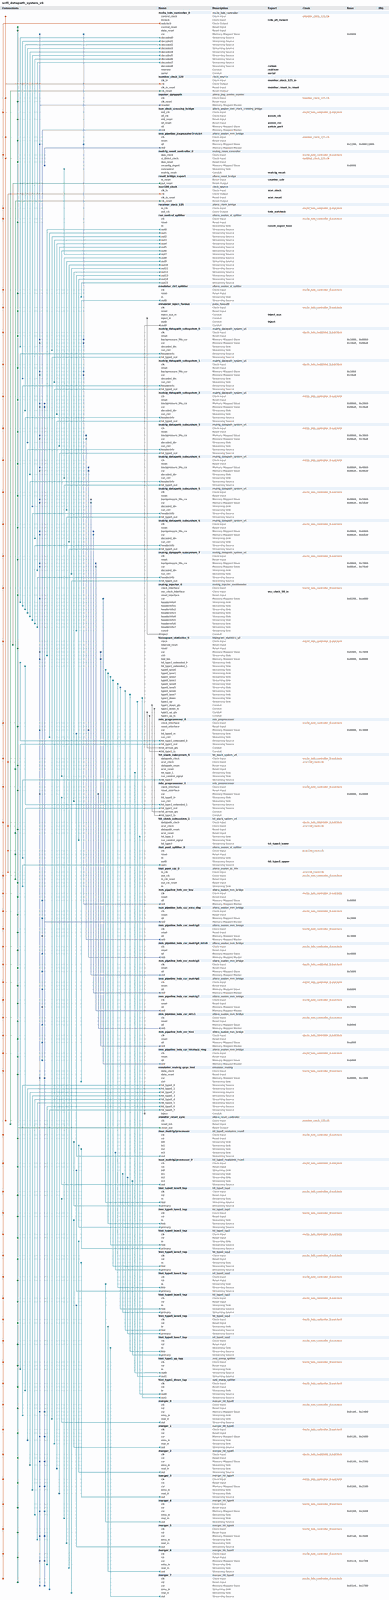
[diagram p0: system contents, whole]
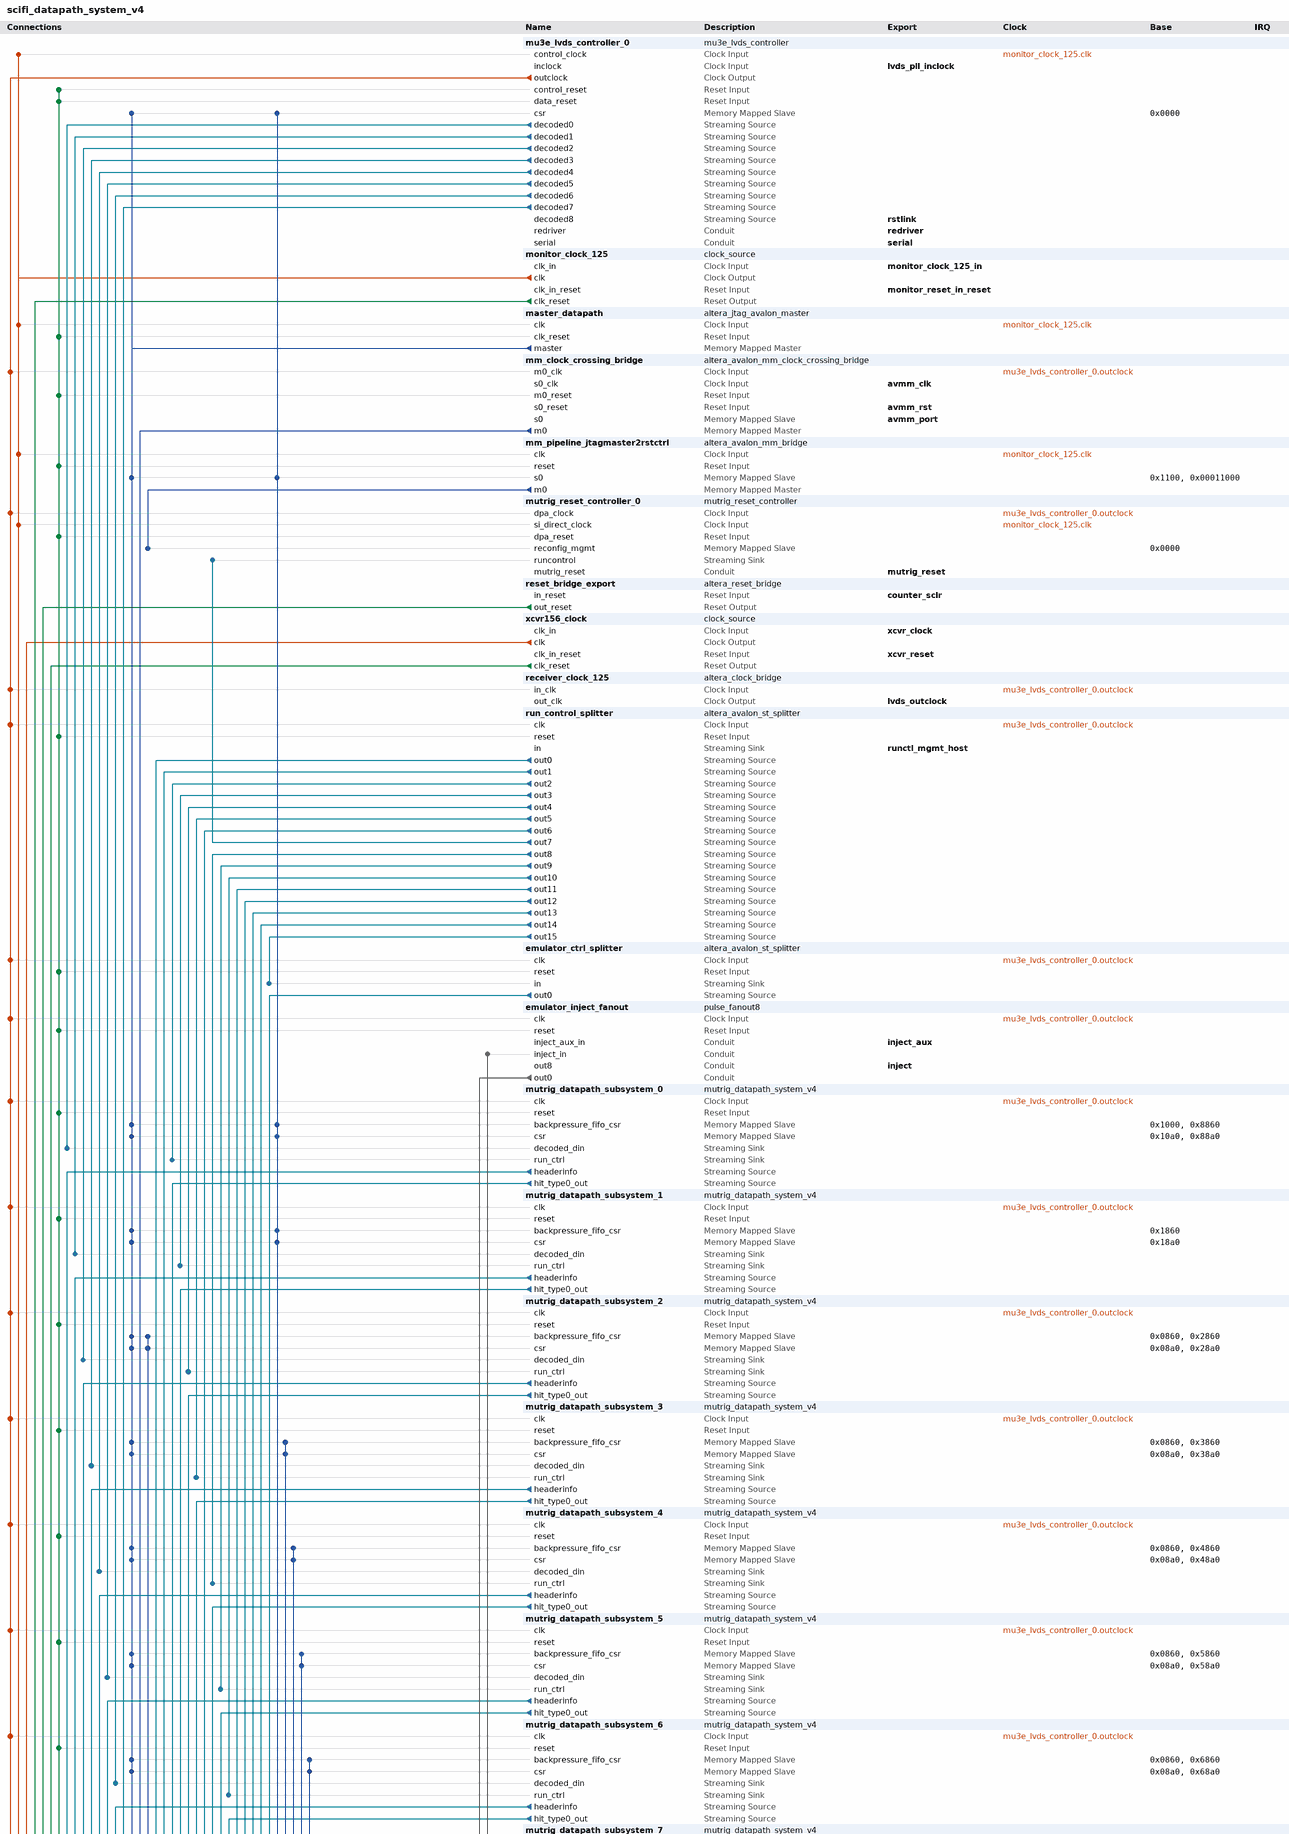
[diagram p1: system contents, upper part]
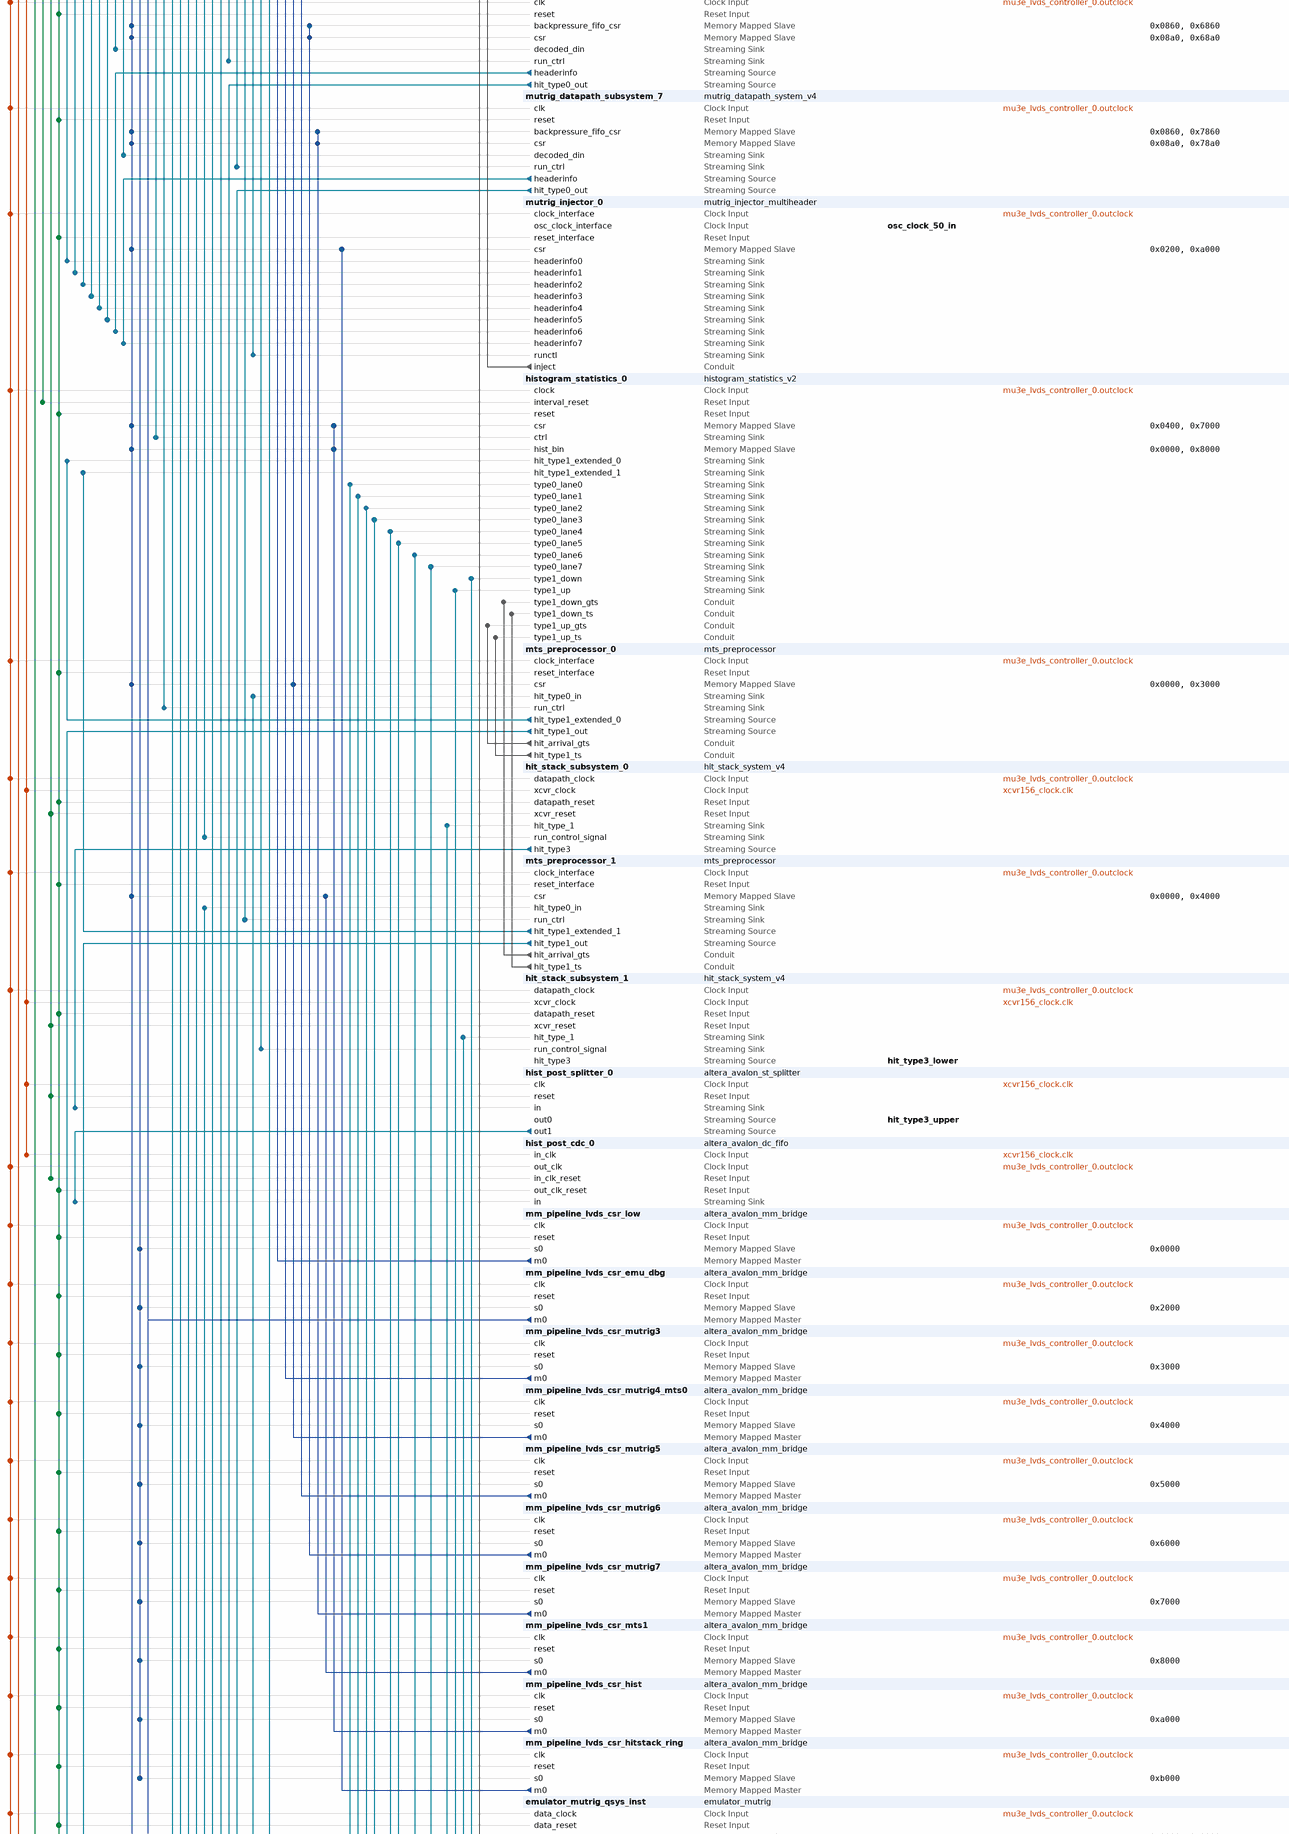
[diagram p2: system contents, middle part]
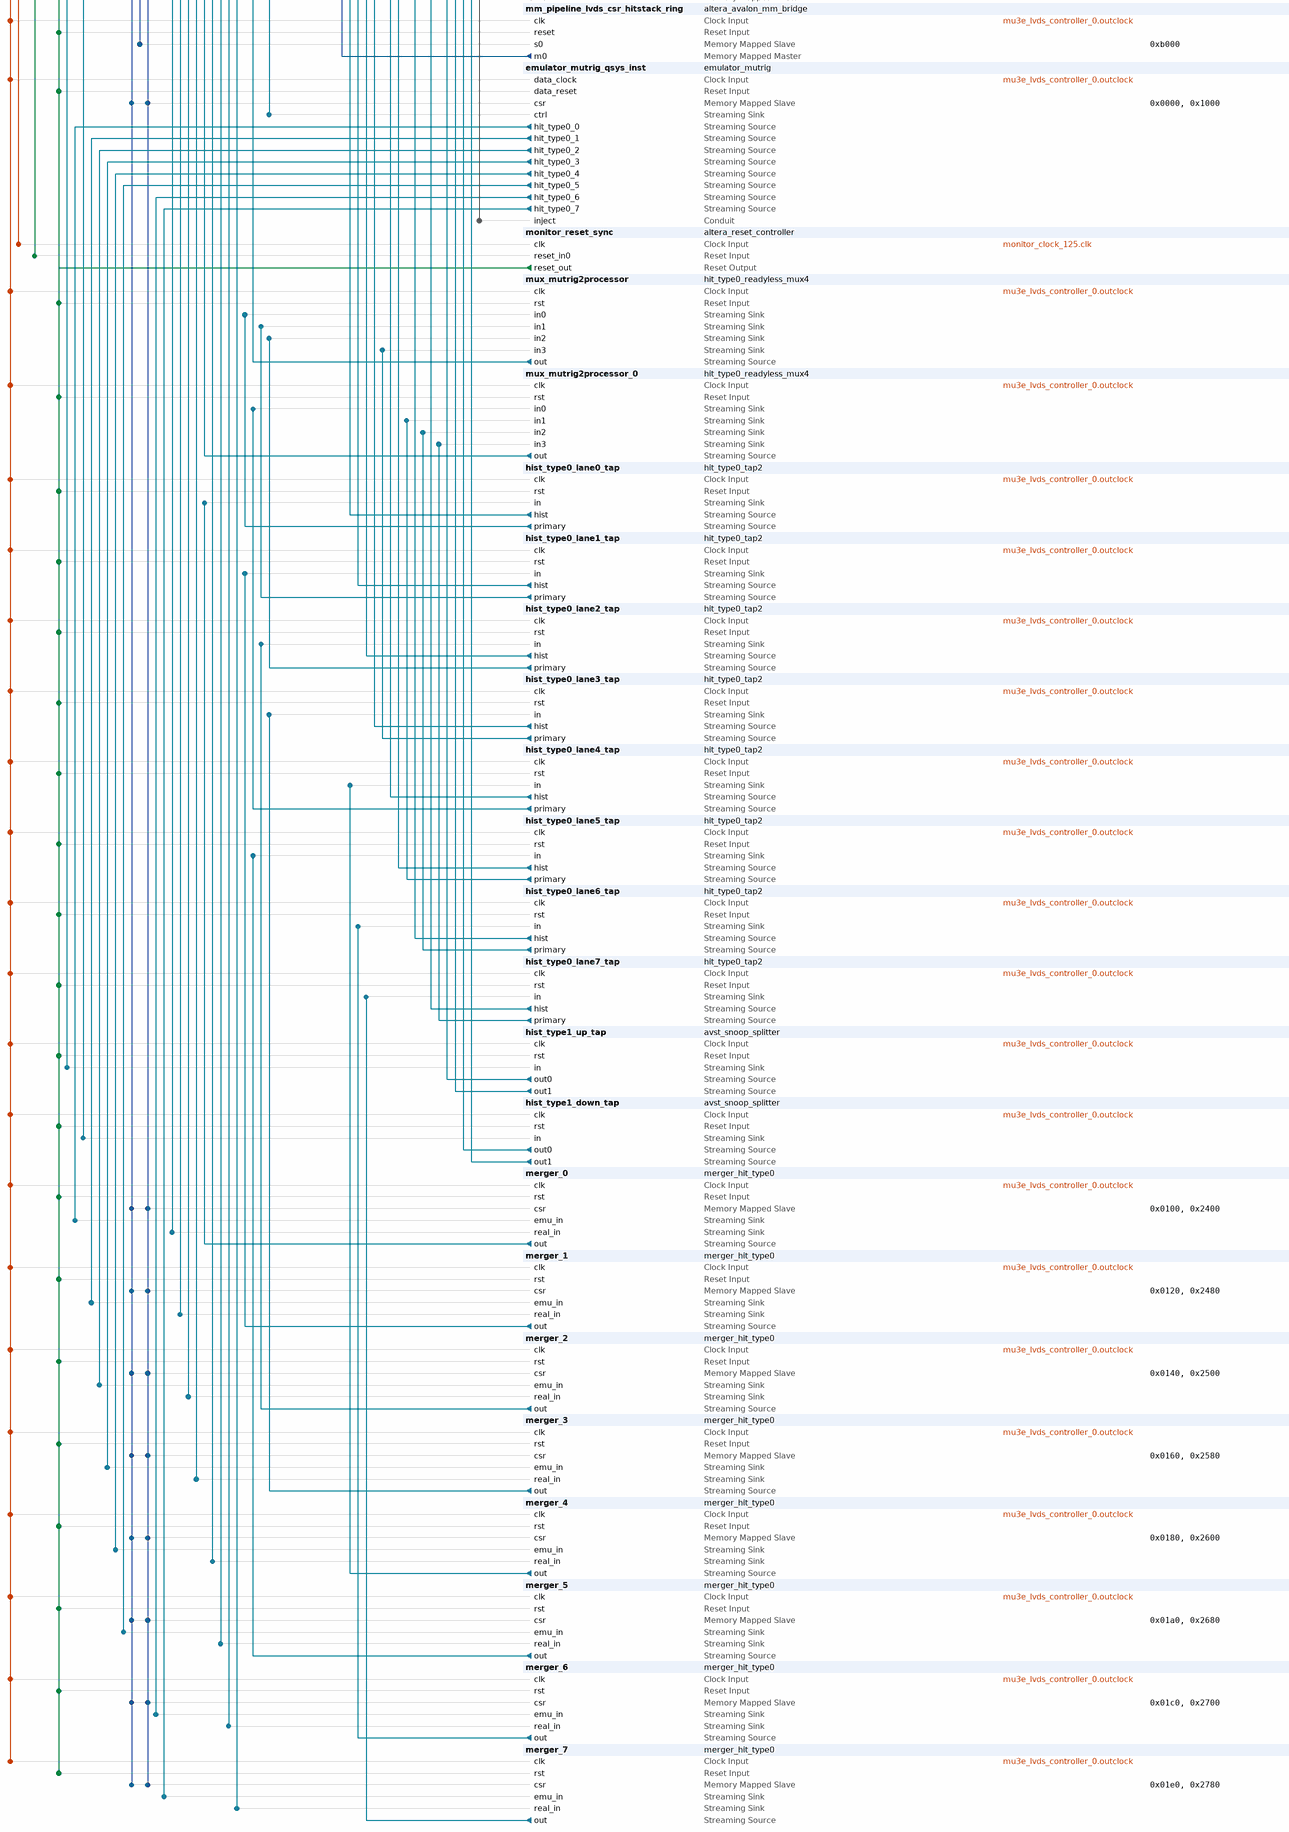
[diagram p3: system contents, lower part]
# Platform Designer (Qsys) system scifi_datapath_system_v4, Arria V 5AGXBA7D4F31C5
# Parameters at their usual value, and those the tool derives, are not listed.
package require -exact qsys 18.1
create_system scifi_datapath_system_v4
set_project_property DEVICE_FAMILY {Arria V}
set_project_property DEVICE 5AGXBA7D4F31C5

add_instance mu3e_lvds_controller_0 mu3e_lvds_controller 26.2.4.522
set_instance_parameter_value mu3e_lvds_controller_0 BUILD 1314
set_instance_parameter_value mu3e_lvds_controller_0 DEBUG_LEVEL 0
set_instance_parameter_value mu3e_lvds_controller_0 INSTANCE_ID 0
set_instance_parameter_value mu3e_lvds_controller_0 IP_UID 1280722003
set_instance_parameter_value mu3e_lvds_controller_0 N_ENGINE 1
set_instance_parameter_value mu3e_lvds_controller_0 N_LANE 9
set_instance_parameter_value mu3e_lvds_controller_0 ROUTING_TOPOLOGY 1
set_instance_parameter_value mu3e_lvds_controller_0 SCORE_ACCEPT 8
set_instance_parameter_value mu3e_lvds_controller_0 SCORE_REJECT 2
set_instance_parameter_value mu3e_lvds_controller_0 SCORE_WINDOW_W 10
set_instance_parameter_value mu3e_lvds_controller_0 STEER_QUEUE_DEPTH 4
set_instance_parameter_value mu3e_lvds_controller_0 SYNC_PATTERN 250
set_instance_parameter_value mu3e_lvds_controller_0 VERSION_DATE 539362594
set_instance_parameter_value mu3e_lvds_controller_0 VERSION_GIT 0
set_instance_parameter_value mu3e_lvds_controller_0 VERSION_MAJOR 26
set_instance_parameter_value mu3e_lvds_controller_0 VERSION_MINOR 2
set_instance_parameter_value mu3e_lvds_controller_0 VERSION_PATCH 3

add_instance monitor_clock_125 clock_source 18.1
set_instance_parameter_value monitor_clock_125 clockFrequency 125000000
set_instance_parameter_value monitor_clock_125 resetSynchronousEdges DEASSERT

add_instance master_datapath altera_jtag_avalon_master 18.1

add_instance mm_clock_crossing_bridge altera_avalon_mm_clock_crossing_bridge 18.1
set_instance_parameter_value mm_clock_crossing_bridge ADDRESS_UNITS WORDS
set_instance_parameter_value mm_clock_crossing_bridge ADDRESS_WIDTH 14
set_instance_parameter_value mm_clock_crossing_bridge COMMAND_FIFO_DEPTH 8
set_instance_parameter_value mm_clock_crossing_bridge DATA_WIDTH 32
set_instance_parameter_value mm_clock_crossing_bridge MASTER_SYNC_DEPTH 2
set_instance_parameter_value mm_clock_crossing_bridge MAX_BURST_SIZE 256
set_instance_parameter_value mm_clock_crossing_bridge RESPONSE_FIFO_DEPTH 512
set_instance_parameter_value mm_clock_crossing_bridge SLAVE_SYNC_DEPTH 2
set_instance_parameter_value mm_clock_crossing_bridge USE_AUTO_ADDRESS_WIDTH 1

add_instance mm_pipeline_jtagmaster2rstctrl altera_avalon_mm_bridge 18.1
set_instance_parameter_value mm_pipeline_jtagmaster2rstctrl ADDRESS_UNITS WORDS
set_instance_parameter_value mm_pipeline_jtagmaster2rstctrl ADDRESS_WIDTH 6
set_instance_parameter_value mm_pipeline_jtagmaster2rstctrl DATA_WIDTH 32
set_instance_parameter_value mm_pipeline_jtagmaster2rstctrl MAX_PENDING_RESPONSES 4
set_instance_parameter_value mm_pipeline_jtagmaster2rstctrl PIPELINE_COMMAND 0
set_instance_parameter_value mm_pipeline_jtagmaster2rstctrl USE_AUTO_ADDRESS_WIDTH 0

add_instance mutrig_reset_controller_0 mutrig_reset_controller 26.0.0.518
set_instance_parameter_value mutrig_reset_controller_0 DEBUG 1
set_instance_parameter_value mutrig_reset_controller_0 RESET_LANE 2

add_instance reset_bridge_export altera_reset_bridge 18.1
set_instance_parameter_value reset_bridge_export ACTIVE_LOW_RESET 0
set_instance_parameter_value reset_bridge_export SYNCHRONOUS_EDGES none

add_instance xcvr156_clock clock_source 18.1
set_instance_parameter_value xcvr156_clock clockFrequency 156250000
set_instance_parameter_value xcvr156_clock resetSynchronousEdges BOTH

add_instance receiver_clock_125 altera_clock_bridge 18.1
set_instance_parameter_value receiver_clock_125 DERIVED_CLOCK_RATE 125000000
set_instance_parameter_value receiver_clock_125 EXPLICIT_CLOCK_RATE 125000000

add_instance run_control_splitter altera_avalon_st_splitter 18.1
set_instance_parameter_value run_control_splitter BITS_PER_SYMBOL 9
set_instance_parameter_value run_control_splitter CHANNEL_WIDTH 1
set_instance_parameter_value run_control_splitter DATA_WIDTH 9
set_instance_parameter_value run_control_splitter ERROR_WIDTH 1
set_instance_parameter_value run_control_splitter MAX_CHANNELS 1
set_instance_parameter_value run_control_splitter NUMBER_OF_OUTPUTS 16
set_instance_parameter_value run_control_splitter QUALIFY_VALID_OUT 0
set_instance_parameter_value run_control_splitter READY_LATENCY 0
set_instance_parameter_value run_control_splitter USE_CHANNEL 0
set_instance_parameter_value run_control_splitter USE_DATA 1
set_instance_parameter_value run_control_splitter USE_ERROR 0
set_instance_parameter_value run_control_splitter USE_PACKETS 0
set_instance_parameter_value run_control_splitter USE_READY 0
set_instance_parameter_value run_control_splitter USE_VALID 1

add_instance emulator_ctrl_splitter altera_avalon_st_splitter 18.1
set_instance_parameter_value emulator_ctrl_splitter BITS_PER_SYMBOL 9
set_instance_parameter_value emulator_ctrl_splitter CHANNEL_WIDTH 1
set_instance_parameter_value emulator_ctrl_splitter DATA_WIDTH 9
set_instance_parameter_value emulator_ctrl_splitter ERROR_WIDTH 1
set_instance_parameter_value emulator_ctrl_splitter MAX_CHANNELS 1
set_instance_parameter_value emulator_ctrl_splitter NUMBER_OF_OUTPUTS 8
set_instance_parameter_value emulator_ctrl_splitter QUALIFY_VALID_OUT 0
set_instance_parameter_value emulator_ctrl_splitter READY_LATENCY 0
set_instance_parameter_value emulator_ctrl_splitter USE_CHANNEL 0
set_instance_parameter_value emulator_ctrl_splitter USE_DATA 1
set_instance_parameter_value emulator_ctrl_splitter USE_ERROR 0
set_instance_parameter_value emulator_ctrl_splitter USE_PACKETS 0
set_instance_parameter_value emulator_ctrl_splitter USE_READY 0
set_instance_parameter_value emulator_ctrl_splitter USE_VALID 1

add_instance emulator_inject_fanout pulse_fanout8 26.0.0.518

add_instance mutrig_datapath_subsystem_0 mutrig_datapath_system_v4 26.4.0.518

add_instance mutrig_datapath_subsystem_1 mutrig_datapath_system_v4 26.4.0.518

add_instance mutrig_datapath_subsystem_2 mutrig_datapath_system_v4 26.4.0.518

add_instance mutrig_datapath_subsystem_3 mutrig_datapath_system_v4 26.4.0.518

add_instance mutrig_datapath_subsystem_4 mutrig_datapath_system_v4 26.4.0.518

add_instance mutrig_datapath_subsystem_5 mutrig_datapath_system_v4 26.4.0.518

add_instance mutrig_datapath_subsystem_6 mutrig_datapath_system_v4 26.4.0.518

add_instance mutrig_datapath_subsystem_7 mutrig_datapath_system_v4 26.4.0.518

add_instance mutrig_injector_0 mutrig_injector_multiheader 26.1.3.519
set_instance_parameter_value mutrig_injector_0 BUILD 517
set_instance_parameter_value mutrig_injector_0 HEADERINFO_CHANNEL_W 4
set_instance_parameter_value mutrig_injector_0 INSTANCE_ID 0
set_instance_parameter_value mutrig_injector_0 IP_UID 1296649802
set_instance_parameter_value mutrig_injector_0 VERSION_DATE 20260517
set_instance_parameter_value mutrig_injector_0 VERSION_GIT 0
set_instance_parameter_value mutrig_injector_0 VERSION_MAJOR 26
set_instance_parameter_value mutrig_injector_0 VERSION_MINOR 1
set_instance_parameter_value mutrig_injector_0 VERSION_PATCH 1

add_instance histogram_statistics_0 histogram_statistics_v2 26.4.5.0605
set_instance_parameter_value histogram_statistics_0 AVST_CHANNEL_WIDTH 4
set_instance_parameter_value histogram_statistics_0 AVST_DATA_WIDTH 45
set_instance_parameter_value histogram_statistics_0 AVS_ADDR_WIDTH 8
set_instance_parameter_value histogram_statistics_0 BUILD 605
set_instance_parameter_value histogram_statistics_0 CHANNELS_PER_PORT 32
set_instance_parameter_value histogram_statistics_0 COAL_QUEUE_DEPTH 4
set_instance_parameter_value histogram_statistics_0 DEBUG 0
set_instance_parameter_value histogram_statistics_0 DEF_BIN_WIDTH 1
set_instance_parameter_value histogram_statistics_0 DEF_INTERVAL_CLOCKS 125000000
set_instance_parameter_value histogram_statistics_0 DEF_LEFT_BOUND 0
set_instance_parameter_value histogram_statistics_0 ENABLE_DEBUG_INPUTS false
set_instance_parameter_value histogram_statistics_0 ENABLE_PACKET false
set_instance_parameter_value histogram_statistics_0 ENABLE_PINGPONG true
set_instance_parameter_value histogram_statistics_0 FIFO_ADDR_WIDTH 5
set_instance_parameter_value histogram_statistics_0 FILTER_KEY_BIT_HI 38
set_instance_parameter_value histogram_statistics_0 FILTER_KEY_BIT_LO 35
set_instance_parameter_value histogram_statistics_0 GIT_STAMP_OVERRIDE false
set_instance_parameter_value histogram_statistics_0 INSTANCE_ID 0
set_instance_parameter_value histogram_statistics_0 IP_UID 1212765012
set_instance_parameter_value histogram_statistics_0 KICK_COUNT_WIDTH 4
set_instance_parameter_value histogram_statistics_0 LOCK_KEY_RANGES true
set_instance_parameter_value histogram_statistics_0 MAX_COUNT_BITS 32
set_instance_parameter_value histogram_statistics_0 N_BINS 256
set_instance_parameter_value histogram_statistics_0 N_DEBUG_INTERFACE 0
set_instance_parameter_value histogram_statistics_0 N_PORTS 8
set_instance_parameter_value histogram_statistics_0 POWER2_BIN_WIDTH_ONLY true
set_instance_parameter_value histogram_statistics_0 SAR_KEY_WIDTH 8
set_instance_parameter_value histogram_statistics_0 SAR_TICK_WIDTH 21
set_instance_parameter_value histogram_statistics_0 SNOOP_EN false
set_instance_parameter_value histogram_statistics_0 TYPE0_DATA_WIDTH 45
set_instance_parameter_value histogram_statistics_0 TYPE1_DATA_WIDTH 39
set_instance_parameter_value histogram_statistics_0 UPDATE_KEY_BIT_HI 34
set_instance_parameter_value histogram_statistics_0 UPDATE_KEY_BIT_LO 30
set_instance_parameter_value histogram_statistics_0 UPDATE_KEY_REPRESENTATION SIGNED
set_instance_parameter_value histogram_statistics_0 VERSION_DATE 20260605
set_instance_parameter_value histogram_statistics_0 VERSION_GIT 0
set_instance_parameter_value histogram_statistics_0 VERSION_MAJOR 26
set_instance_parameter_value histogram_statistics_0 VERSION_MINOR 4
set_instance_parameter_value histogram_statistics_0 VERSION_PATCH 5

add_instance mts_preprocessor_0 mts_preprocessor 26.3.7.521
set_instance_parameter_value mts_preprocessor_0 BANK UP
set_instance_parameter_value mts_preprocessor_0 BUILD 517
set_instance_parameter_value mts_preprocessor_0 CRCERR_BIT_LOC 1
set_instance_parameter_value mts_preprocessor_0 DEBUG 0
set_instance_parameter_value mts_preprocessor_0 DV_COUNTER_SEED_ENABLE 0
set_instance_parameter_value mts_preprocessor_0 ENABLED_CHANNEL_HI 3
set_instance_parameter_value mts_preprocessor_0 ENABLED_CHANNEL_LO 0
set_instance_parameter_value mts_preprocessor_0 FRAME_CORRPT_BIT_LOC 2
set_instance_parameter_value mts_preprocessor_0 GIT_STAMP_OVERRIDE false
set_instance_parameter_value mts_preprocessor_0 HITERR_BIT_LOC 0
set_instance_parameter_value mts_preprocessor_0 INSTANCE_ID 0
set_instance_parameter_value mts_preprocessor_0 IP_UID 1297376080
set_instance_parameter_value mts_preprocessor_0 LPM_DIV_PIPELINE 4
set_instance_parameter_value mts_preprocessor_0 MUTRIG_BUFFER_EXPECTED_LATENCY_8N 2000
set_instance_parameter_value mts_preprocessor_0 MUTRIG_OVERFLOW_LOOKBACK_8N 2000
set_instance_parameter_value mts_preprocessor_0 PADDING_EOP_WAIT_CYCLE 512
set_instance_parameter_value mts_preprocessor_0 VERSION_DATE 20260517
set_instance_parameter_value mts_preprocessor_0 VERSION_GIT 30068584
set_instance_parameter_value mts_preprocessor_0 VERSION_MAJOR 26
set_instance_parameter_value mts_preprocessor_0 VERSION_MINOR 3
set_instance_parameter_value mts_preprocessor_0 VERSION_PATCH 3

add_instance hit_stack_subsystem_0 hit_stack_system_v4 26.4.0.518

add_instance mts_preprocessor_1 mts_preprocessor 26.3.7.521
set_instance_parameter_value mts_preprocessor_1 BANK DW
set_instance_parameter_value mts_preprocessor_1 BUILD 517
set_instance_parameter_value mts_preprocessor_1 CRCERR_BIT_LOC 1
set_instance_parameter_value mts_preprocessor_1 DEBUG 0
set_instance_parameter_value mts_preprocessor_1 DV_COUNTER_SEED_ENABLE 0
set_instance_parameter_value mts_preprocessor_1 ENABLED_CHANNEL_HI 7
set_instance_parameter_value mts_preprocessor_1 ENABLED_CHANNEL_LO 4
set_instance_parameter_value mts_preprocessor_1 FRAME_CORRPT_BIT_LOC 2
set_instance_parameter_value mts_preprocessor_1 GIT_STAMP_OVERRIDE false
set_instance_parameter_value mts_preprocessor_1 HITERR_BIT_LOC 0
set_instance_parameter_value mts_preprocessor_1 INSTANCE_ID 0
set_instance_parameter_value mts_preprocessor_1 IP_UID 1297376080
set_instance_parameter_value mts_preprocessor_1 LPM_DIV_PIPELINE 4
set_instance_parameter_value mts_preprocessor_1 MUTRIG_BUFFER_EXPECTED_LATENCY_8N 2000
set_instance_parameter_value mts_preprocessor_1 MUTRIG_OVERFLOW_LOOKBACK_8N 2000
set_instance_parameter_value mts_preprocessor_1 PADDING_EOP_WAIT_CYCLE 512
set_instance_parameter_value mts_preprocessor_1 VERSION_DATE 20260517
set_instance_parameter_value mts_preprocessor_1 VERSION_GIT 30068584
set_instance_parameter_value mts_preprocessor_1 VERSION_MAJOR 26
set_instance_parameter_value mts_preprocessor_1 VERSION_MINOR 3
set_instance_parameter_value mts_preprocessor_1 VERSION_PATCH 3

add_instance hit_stack_subsystem_1 hit_stack_system_v4 26.4.0.518

add_instance hist_post_splitter_0 altera_avalon_st_splitter 18.1
set_instance_parameter_value hist_post_splitter_0 BITS_PER_SYMBOL 36
set_instance_parameter_value hist_post_splitter_0 CHANNEL_WIDTH 1
set_instance_parameter_value hist_post_splitter_0 DATA_WIDTH 36
set_instance_parameter_value hist_post_splitter_0 ERROR_WIDTH 1
set_instance_parameter_value hist_post_splitter_0 MAX_CHANNELS 1
set_instance_parameter_value hist_post_splitter_0 NUMBER_OF_OUTPUTS 2
set_instance_parameter_value hist_post_splitter_0 QUALIFY_VALID_OUT 0
set_instance_parameter_value hist_post_splitter_0 READY_LATENCY 0
set_instance_parameter_value hist_post_splitter_0 USE_CHANNEL 0
set_instance_parameter_value hist_post_splitter_0 USE_DATA 1
set_instance_parameter_value hist_post_splitter_0 USE_ERROR 0
set_instance_parameter_value hist_post_splitter_0 USE_PACKETS 1
set_instance_parameter_value hist_post_splitter_0 USE_READY 1
set_instance_parameter_value hist_post_splitter_0 USE_VALID 1

add_instance hist_post_cdc_0 altera_avalon_dc_fifo 18.1
set_instance_parameter_value hist_post_cdc_0 BITS_PER_SYMBOL 36
set_instance_parameter_value hist_post_cdc_0 FIFO_DEPTH 256
set_instance_parameter_value hist_post_cdc_0 USE_PACKETS 1

add_instance mm_pipeline_lvds_csr_low altera_avalon_mm_bridge 18.1
set_instance_parameter_value mm_pipeline_lvds_csr_low ADDRESS_UNITS WORDS
set_instance_parameter_value mm_pipeline_lvds_csr_low ADDRESS_WIDTH 13
set_instance_parameter_value mm_pipeline_lvds_csr_low DATA_WIDTH 32
set_instance_parameter_value mm_pipeline_lvds_csr_low MAX_PENDING_RESPONSES 4
set_instance_parameter_value mm_pipeline_lvds_csr_low USE_AUTO_ADDRESS_WIDTH 1

add_instance mm_pipeline_lvds_csr_emu_dbg altera_avalon_mm_bridge 18.1
set_instance_parameter_value mm_pipeline_lvds_csr_emu_dbg ADDRESS_UNITS WORDS
set_instance_parameter_value mm_pipeline_lvds_csr_emu_dbg ADDRESS_WIDTH 12
set_instance_parameter_value mm_pipeline_lvds_csr_emu_dbg DATA_WIDTH 32
set_instance_parameter_value mm_pipeline_lvds_csr_emu_dbg MAX_PENDING_RESPONSES 4
set_instance_parameter_value mm_pipeline_lvds_csr_emu_dbg USE_AUTO_ADDRESS_WIDTH 1

add_instance mm_pipeline_lvds_csr_mutrig3 altera_avalon_mm_bridge 18.1
set_instance_parameter_value mm_pipeline_lvds_csr_mutrig3 ADDRESS_UNITS WORDS
set_instance_parameter_value mm_pipeline_lvds_csr_mutrig3 ADDRESS_WIDTH 12
set_instance_parameter_value mm_pipeline_lvds_csr_mutrig3 DATA_WIDTH 32
set_instance_parameter_value mm_pipeline_lvds_csr_mutrig3 MAX_PENDING_RESPONSES 4
set_instance_parameter_value mm_pipeline_lvds_csr_mutrig3 USE_AUTO_ADDRESS_WIDTH 1

add_instance mm_pipeline_lvds_csr_mutrig4_mts0 altera_avalon_mm_bridge 18.1
set_instance_parameter_value mm_pipeline_lvds_csr_mutrig4_mts0 ADDRESS_UNITS WORDS
set_instance_parameter_value mm_pipeline_lvds_csr_mutrig4_mts0 ADDRESS_WIDTH 12
set_instance_parameter_value mm_pipeline_lvds_csr_mutrig4_mts0 DATA_WIDTH 32
set_instance_parameter_value mm_pipeline_lvds_csr_mutrig4_mts0 MAX_PENDING_RESPONSES 4
set_instance_parameter_value mm_pipeline_lvds_csr_mutrig4_mts0 USE_AUTO_ADDRESS_WIDTH 1

add_instance mm_pipeline_lvds_csr_mutrig5 altera_avalon_mm_bridge 18.1
set_instance_parameter_value mm_pipeline_lvds_csr_mutrig5 ADDRESS_UNITS WORDS
set_instance_parameter_value mm_pipeline_lvds_csr_mutrig5 ADDRESS_WIDTH 12
set_instance_parameter_value mm_pipeline_lvds_csr_mutrig5 DATA_WIDTH 32
set_instance_parameter_value mm_pipeline_lvds_csr_mutrig5 MAX_PENDING_RESPONSES 4
set_instance_parameter_value mm_pipeline_lvds_csr_mutrig5 USE_AUTO_ADDRESS_WIDTH 1

add_instance mm_pipeline_lvds_csr_mutrig6 altera_avalon_mm_bridge 18.1
set_instance_parameter_value mm_pipeline_lvds_csr_mutrig6 ADDRESS_UNITS WORDS
set_instance_parameter_value mm_pipeline_lvds_csr_mutrig6 ADDRESS_WIDTH 12
set_instance_parameter_value mm_pipeline_lvds_csr_mutrig6 DATA_WIDTH 32
set_instance_parameter_value mm_pipeline_lvds_csr_mutrig6 MAX_PENDING_RESPONSES 4
set_instance_parameter_value mm_pipeline_lvds_csr_mutrig6 USE_AUTO_ADDRESS_WIDTH 1

add_instance mm_pipeline_lvds_csr_mutrig7 altera_avalon_mm_bridge 18.1
set_instance_parameter_value mm_pipeline_lvds_csr_mutrig7 ADDRESS_UNITS WORDS
set_instance_parameter_value mm_pipeline_lvds_csr_mutrig7 ADDRESS_WIDTH 12
set_instance_parameter_value mm_pipeline_lvds_csr_mutrig7 DATA_WIDTH 32
set_instance_parameter_value mm_pipeline_lvds_csr_mutrig7 MAX_PENDING_RESPONSES 4
set_instance_parameter_value mm_pipeline_lvds_csr_mutrig7 USE_AUTO_ADDRESS_WIDTH 1

add_instance mm_pipeline_lvds_csr_mts1 altera_avalon_mm_bridge 18.1
set_instance_parameter_value mm_pipeline_lvds_csr_mts1 ADDRESS_UNITS WORDS
set_instance_parameter_value mm_pipeline_lvds_csr_mts1 ADDRESS_WIDTH 12
set_instance_parameter_value mm_pipeline_lvds_csr_mts1 DATA_WIDTH 32
set_instance_parameter_value mm_pipeline_lvds_csr_mts1 MAX_PENDING_RESPONSES 4
set_instance_parameter_value mm_pipeline_lvds_csr_mts1 USE_AUTO_ADDRESS_WIDTH 1

add_instance mm_pipeline_lvds_csr_hist altera_avalon_mm_bridge 18.1
set_instance_parameter_value mm_pipeline_lvds_csr_hist ADDRESS_UNITS WORDS
set_instance_parameter_value mm_pipeline_lvds_csr_hist ADDRESS_WIDTH 12
set_instance_parameter_value mm_pipeline_lvds_csr_hist DATA_WIDTH 32
set_instance_parameter_value mm_pipeline_lvds_csr_hist MAX_PENDING_RESPONSES 4
set_instance_parameter_value mm_pipeline_lvds_csr_hist USE_AUTO_ADDRESS_WIDTH 1

add_instance mm_pipeline_lvds_csr_hitstack_ring altera_avalon_mm_bridge 18.1
set_instance_parameter_value mm_pipeline_lvds_csr_hitstack_ring ADDRESS_UNITS WORDS
set_instance_parameter_value mm_pipeline_lvds_csr_hitstack_ring ADDRESS_WIDTH 12
set_instance_parameter_value mm_pipeline_lvds_csr_hitstack_ring DATA_WIDTH 32
set_instance_parameter_value mm_pipeline_lvds_csr_hitstack_ring MAX_PENDING_RESPONSES 4
set_instance_parameter_value mm_pipeline_lvds_csr_hitstack_ring USE_AUTO_ADDRESS_WIDTH 1

add_instance emulator_mutrig_qsys_inst emulator_mutrig 26.3.6.520
set_instance_parameter_value emulator_mutrig_qsys_inst ASIC_ID_DEFAULT 0
set_instance_parameter_value emulator_mutrig_qsys_inst BUILD 520
set_instance_parameter_value emulator_mutrig_qsys_inst BYTE_STREAM_ENABLE false
set_instance_parameter_value emulator_mutrig_qsys_inst CLUSTER_CENTER_GLOBAL_DEFAULT 16
set_instance_parameter_value emulator_mutrig_qsys_inst CLUSTER_CROSS_ASIC_DEFAULT 0
set_instance_parameter_value emulator_mutrig_qsys_inst CLUSTER_LANE_COUNT_DEFAULT 8
set_instance_parameter_value emulator_mutrig_qsys_inst CLUSTER_LANE_INDEX_DEFAULT 0
set_instance_parameter_value emulator_mutrig_qsys_inst CSR_ADDR_WIDTH 6
set_instance_parameter_value emulator_mutrig_qsys_inst DEBUG_LEVEL 0
set_instance_parameter_value emulator_mutrig_qsys_inst FIFO_DEPTH 64
set_instance_parameter_value emulator_mutrig_qsys_inst GIT_STAMP_OVERRIDE false
set_instance_parameter_value emulator_mutrig_qsys_inst INSTANCE_ID 0
set_instance_parameter_value emulator_mutrig_qsys_inst IP_UID 1162696020
set_instance_parameter_value emulator_mutrig_qsys_inst VERSION_DATE 20260520
set_instance_parameter_value emulator_mutrig_qsys_inst VERSION_GIT 0
set_instance_parameter_value emulator_mutrig_qsys_inst VERSION_MAJOR 26
set_instance_parameter_value emulator_mutrig_qsys_inst VERSION_MINOR 3
set_instance_parameter_value emulator_mutrig_qsys_inst VERSION_PATCH 6

add_instance monitor_reset_sync altera_reset_controller 18.1
set_instance_parameter_value monitor_reset_sync NUM_RESET_INPUTS 1
set_instance_parameter_value monitor_reset_sync SYNC_DEPTH 2

add_instance mux_mutrig2processor hit_type0_readyless_mux4 26.1.0.516
set_instance_parameter_value mux_mutrig2processor DEBUG_LEVEL 0
set_instance_parameter_value mux_mutrig2processor FIFO_DEPTH 16

add_instance mux_mutrig2processor_0 hit_type0_readyless_mux4 26.1.0.516
set_instance_parameter_value mux_mutrig2processor_0 DEBUG_LEVEL 0
set_instance_parameter_value mux_mutrig2processor_0 FIFO_DEPTH 16

add_instance hist_type0_lane0_tap hit_type0_tap2 26.0.0.517
set_instance_parameter_value hist_type0_lane0_tap CHANNEL_WIDTH 4
set_instance_parameter_value hist_type0_lane0_tap DATA_WIDTH 45
set_instance_parameter_value hist_type0_lane0_tap ERROR_WIDTH 3

add_instance hist_type0_lane1_tap hit_type0_tap2 26.0.0.517
set_instance_parameter_value hist_type0_lane1_tap CHANNEL_WIDTH 4
set_instance_parameter_value hist_type0_lane1_tap DATA_WIDTH 45
set_instance_parameter_value hist_type0_lane1_tap ERROR_WIDTH 3

add_instance hist_type0_lane2_tap hit_type0_tap2 26.0.0.517
set_instance_parameter_value hist_type0_lane2_tap CHANNEL_WIDTH 4
set_instance_parameter_value hist_type0_lane2_tap DATA_WIDTH 45
set_instance_parameter_value hist_type0_lane2_tap ERROR_WIDTH 3

add_instance hist_type0_lane3_tap hit_type0_tap2 26.0.0.517
set_instance_parameter_value hist_type0_lane3_tap CHANNEL_WIDTH 4
set_instance_parameter_value hist_type0_lane3_tap DATA_WIDTH 45
set_instance_parameter_value hist_type0_lane3_tap ERROR_WIDTH 3

add_instance hist_type0_lane4_tap hit_type0_tap2 26.0.0.517
set_instance_parameter_value hist_type0_lane4_tap CHANNEL_WIDTH 4
set_instance_parameter_value hist_type0_lane4_tap DATA_WIDTH 45
set_instance_parameter_value hist_type0_lane4_tap ERROR_WIDTH 3

add_instance hist_type0_lane5_tap hit_type0_tap2 26.0.0.517
set_instance_parameter_value hist_type0_lane5_tap CHANNEL_WIDTH 4
set_instance_parameter_value hist_type0_lane5_tap DATA_WIDTH 45
set_instance_parameter_value hist_type0_lane5_tap ERROR_WIDTH 3

add_instance hist_type0_lane6_tap hit_type0_tap2 26.0.0.517
set_instance_parameter_value hist_type0_lane6_tap CHANNEL_WIDTH 4
set_instance_parameter_value hist_type0_lane6_tap DATA_WIDTH 45
set_instance_parameter_value hist_type0_lane6_tap ERROR_WIDTH 3

add_instance hist_type0_lane7_tap hit_type0_tap2 26.0.0.517
set_instance_parameter_value hist_type0_lane7_tap CHANNEL_WIDTH 4
set_instance_parameter_value hist_type0_lane7_tap DATA_WIDTH 45
set_instance_parameter_value hist_type0_lane7_tap ERROR_WIDTH 3

add_instance hist_type1_up_tap avst_snoop_splitter 26.0.0.502
set_instance_parameter_value hist_type1_up_tap CHANNEL_WIDTH 4
set_instance_parameter_value hist_type1_up_tap DATA_WIDTH 39
set_instance_parameter_value hist_type1_up_tap EMPTY_WIDTH 1
set_instance_parameter_value hist_type1_up_tap ERROR_WIDTH 1

add_instance hist_type1_down_tap avst_snoop_splitter 26.0.0.502
set_instance_parameter_value hist_type1_down_tap CHANNEL_WIDTH 4
set_instance_parameter_value hist_type1_down_tap DATA_WIDTH 39
set_instance_parameter_value hist_type1_down_tap EMPTY_WIDTH 1
set_instance_parameter_value hist_type1_down_tap ERROR_WIDTH 1

add_instance merger_0 merger_hit_type0 26.0.0.519
set_instance_parameter_value merger_0 BUILD 519
set_instance_parameter_value merger_0 CHANNEL_WIDTH 4
set_instance_parameter_value merger_0 DATA_WIDTH 45
set_instance_parameter_value merger_0 ERROR_WIDTH 3
set_instance_parameter_value merger_0 INSTANCE_ID 0
set_instance_parameter_value merger_0 IP_UID 1296582484
set_instance_parameter_value merger_0 SOURCE_SEL_DEFAULT 1
set_instance_parameter_value merger_0 VERSION_DATE 20260519
set_instance_parameter_value merger_0 VERSION_MAJOR 26
set_instance_parameter_value merger_0 VERSION_MINOR 0
set_instance_parameter_value merger_0 VERSION_PATCH 0

add_instance merger_1 merger_hit_type0 26.0.0.519
set_instance_parameter_value merger_1 BUILD 519
set_instance_parameter_value merger_1 CHANNEL_WIDTH 4
set_instance_parameter_value merger_1 DATA_WIDTH 45
set_instance_parameter_value merger_1 ERROR_WIDTH 3
set_instance_parameter_value merger_1 INSTANCE_ID 1
set_instance_parameter_value merger_1 IP_UID 1296582484
set_instance_parameter_value merger_1 SOURCE_SEL_DEFAULT 1
set_instance_parameter_value merger_1 VERSION_DATE 20260519
set_instance_parameter_value merger_1 VERSION_MAJOR 26
set_instance_parameter_value merger_1 VERSION_MINOR 0
set_instance_parameter_value merger_1 VERSION_PATCH 0

add_instance merger_2 merger_hit_type0 26.0.0.519
set_instance_parameter_value merger_2 BUILD 519
set_instance_parameter_value merger_2 CHANNEL_WIDTH 4
set_instance_parameter_value merger_2 DATA_WIDTH 45
set_instance_parameter_value merger_2 ERROR_WIDTH 3
set_instance_parameter_value merger_2 INSTANCE_ID 2
set_instance_parameter_value merger_2 IP_UID 1296582484
set_instance_parameter_value merger_2 SOURCE_SEL_DEFAULT 1
set_instance_parameter_value merger_2 VERSION_DATE 20260519
set_instance_parameter_value merger_2 VERSION_MAJOR 26
set_instance_parameter_value merger_2 VERSION_MINOR 0
set_instance_parameter_value merger_2 VERSION_PATCH 0

add_instance merger_3 merger_hit_type0 26.0.0.519
set_instance_parameter_value merger_3 BUILD 519
set_instance_parameter_value merger_3 CHANNEL_WIDTH 4
set_instance_parameter_value merger_3 DATA_WIDTH 45
set_instance_parameter_value merger_3 ERROR_WIDTH 3
set_instance_parameter_value merger_3 INSTANCE_ID 3
set_instance_parameter_value merger_3 IP_UID 1296582484
set_instance_parameter_value merger_3 SOURCE_SEL_DEFAULT 1
set_instance_parameter_value merger_3 VERSION_DATE 20260519
set_instance_parameter_value merger_3 VERSION_MAJOR 26
set_instance_parameter_value merger_3 VERSION_MINOR 0
set_instance_parameter_value merger_3 VERSION_PATCH 0

add_instance merger_4 merger_hit_type0 26.0.0.519
set_instance_parameter_value merger_4 BUILD 519
set_instance_parameter_value merger_4 CHANNEL_WIDTH 4
set_instance_parameter_value merger_4 DATA_WIDTH 45
set_instance_parameter_value merger_4 ERROR_WIDTH 3
set_instance_parameter_value merger_4 INSTANCE_ID 4
set_instance_parameter_value merger_4 IP_UID 1296582484
set_instance_parameter_value merger_4 SOURCE_SEL_DEFAULT 1
set_instance_parameter_value merger_4 VERSION_DATE 20260519
set_instance_parameter_value merger_4 VERSION_MAJOR 26
set_instance_parameter_value merger_4 VERSION_MINOR 0
set_instance_parameter_value merger_4 VERSION_PATCH 0

add_instance merger_5 merger_hit_type0 26.0.0.519
set_instance_parameter_value merger_5 BUILD 519
set_instance_parameter_value merger_5 CHANNEL_WIDTH 4
set_instance_parameter_value merger_5 DATA_WIDTH 45
set_instance_parameter_value merger_5 ERROR_WIDTH 3
set_instance_parameter_value merger_5 INSTANCE_ID 5
set_instance_parameter_value merger_5 IP_UID 1296582484
set_instance_parameter_value merger_5 SOURCE_SEL_DEFAULT 1
set_instance_parameter_value merger_5 VERSION_DATE 20260519
set_instance_parameter_value merger_5 VERSION_MAJOR 26
set_instance_parameter_value merger_5 VERSION_MINOR 0
set_instance_parameter_value merger_5 VERSION_PATCH 0

add_instance merger_6 merger_hit_type0 26.0.0.519
set_instance_parameter_value merger_6 BUILD 519
set_instance_parameter_value merger_6 CHANNEL_WIDTH 4
set_instance_parameter_value merger_6 DATA_WIDTH 45
set_instance_parameter_value merger_6 ERROR_WIDTH 3
set_instance_parameter_value merger_6 INSTANCE_ID 6
set_instance_parameter_value merger_6 IP_UID 1296582484
set_instance_parameter_value merger_6 SOURCE_SEL_DEFAULT 1
set_instance_parameter_value merger_6 VERSION_DATE 20260519
set_instance_parameter_value merger_6 VERSION_MAJOR 26
set_instance_parameter_value merger_6 VERSION_MINOR 0
set_instance_parameter_value merger_6 VERSION_PATCH 0

add_instance merger_7 merger_hit_type0 26.0.0.519
set_instance_parameter_value merger_7 BUILD 519
set_instance_parameter_value merger_7 CHANNEL_WIDTH 4
set_instance_parameter_value merger_7 DATA_WIDTH 45
set_instance_parameter_value merger_7 ERROR_WIDTH 3
set_instance_parameter_value merger_7 INSTANCE_ID 7
set_instance_parameter_value merger_7 IP_UID 1296582484
set_instance_parameter_value merger_7 SOURCE_SEL_DEFAULT 1
set_instance_parameter_value merger_7 VERSION_DATE 20260519
set_instance_parameter_value merger_7 VERSION_MAJOR 26
set_instance_parameter_value merger_7 VERSION_MINOR 0
set_instance_parameter_value merger_7 VERSION_PATCH 0

# connections
add_connection monitor_clock_125.clk master_datapath.clk clock
add_connection monitor_clock_125.clk mm_pipeline_jtagmaster2rstctrl.clk clock
add_connection monitor_clock_125.clk monitor_reset_sync.clk clock
add_connection monitor_clock_125.clk mu3e_lvds_controller_0.control_clock clock
add_connection monitor_clock_125.clk mutrig_reset_controller_0.si_direct_clock clock
add_connection mu3e_lvds_controller_0.outclock emulator_ctrl_splitter.clk clock
add_connection mu3e_lvds_controller_0.outclock emulator_inject_fanout.clk clock
add_connection mu3e_lvds_controller_0.outclock emulator_mutrig_qsys_inst.data_clock clock
add_connection mu3e_lvds_controller_0.outclock hist_post_cdc_0.out_clk clock
add_connection mu3e_lvds_controller_0.outclock hist_type0_lane0_tap.clk clock
add_connection mu3e_lvds_controller_0.outclock hist_type0_lane1_tap.clk clock
add_connection mu3e_lvds_controller_0.outclock hist_type0_lane2_tap.clk clock
add_connection mu3e_lvds_controller_0.outclock hist_type0_lane3_tap.clk clock
add_connection mu3e_lvds_controller_0.outclock hist_type0_lane4_tap.clk clock
add_connection mu3e_lvds_controller_0.outclock hist_type0_lane5_tap.clk clock
add_connection mu3e_lvds_controller_0.outclock hist_type0_lane6_tap.clk clock
add_connection mu3e_lvds_controller_0.outclock hist_type0_lane7_tap.clk clock
add_connection mu3e_lvds_controller_0.outclock hist_type1_down_tap.clk clock
add_connection mu3e_lvds_controller_0.outclock hist_type1_up_tap.clk clock
add_connection mu3e_lvds_controller_0.outclock histogram_statistics_0.clock clock
add_connection mu3e_lvds_controller_0.outclock hit_stack_subsystem_0.datapath_clock clock
add_connection mu3e_lvds_controller_0.outclock hit_stack_subsystem_1.datapath_clock clock
add_connection mu3e_lvds_controller_0.outclock merger_0.clk clock
add_connection mu3e_lvds_controller_0.outclock merger_1.clk clock
add_connection mu3e_lvds_controller_0.outclock merger_2.clk clock
add_connection mu3e_lvds_controller_0.outclock merger_3.clk clock
add_connection mu3e_lvds_controller_0.outclock merger_4.clk clock
add_connection mu3e_lvds_controller_0.outclock merger_5.clk clock
add_connection mu3e_lvds_controller_0.outclock merger_6.clk clock
add_connection mu3e_lvds_controller_0.outclock merger_7.clk clock
add_connection mu3e_lvds_controller_0.outclock mm_clock_crossing_bridge.m0_clk clock
add_connection mu3e_lvds_controller_0.outclock mm_pipeline_lvds_csr_emu_dbg.clk clock
add_connection mu3e_lvds_controller_0.outclock mm_pipeline_lvds_csr_hist.clk clock
add_connection mu3e_lvds_controller_0.outclock mm_pipeline_lvds_csr_hitstack_ring.clk clock
add_connection mu3e_lvds_controller_0.outclock mm_pipeline_lvds_csr_low.clk clock
add_connection mu3e_lvds_controller_0.outclock mm_pipeline_lvds_csr_mts1.clk clock
add_connection mu3e_lvds_controller_0.outclock mm_pipeline_lvds_csr_mutrig3.clk clock
add_connection mu3e_lvds_controller_0.outclock mm_pipeline_lvds_csr_mutrig4_mts0.clk clock
add_connection mu3e_lvds_controller_0.outclock mm_pipeline_lvds_csr_mutrig5.clk clock
add_connection mu3e_lvds_controller_0.outclock mm_pipeline_lvds_csr_mutrig6.clk clock
add_connection mu3e_lvds_controller_0.outclock mm_pipeline_lvds_csr_mutrig7.clk clock
add_connection mu3e_lvds_controller_0.outclock mts_preprocessor_0.clock_interface clock
add_connection mu3e_lvds_controller_0.outclock mts_preprocessor_1.clock_interface clock
add_connection mu3e_lvds_controller_0.outclock mutrig_datapath_subsystem_0.clk clock
add_connection mu3e_lvds_controller_0.outclock mutrig_datapath_subsystem_1.clk clock
add_connection mu3e_lvds_controller_0.outclock mutrig_datapath_subsystem_2.clk clock
add_connection mu3e_lvds_controller_0.outclock mutrig_datapath_subsystem_3.clk clock
add_connection mu3e_lvds_controller_0.outclock mutrig_datapath_subsystem_4.clk clock
add_connection mu3e_lvds_controller_0.outclock mutrig_datapath_subsystem_5.clk clock
add_connection mu3e_lvds_controller_0.outclock mutrig_datapath_subsystem_6.clk clock
add_connection mu3e_lvds_controller_0.outclock mutrig_datapath_subsystem_7.clk clock
add_connection mu3e_lvds_controller_0.outclock mutrig_injector_0.clock_interface clock
add_connection mu3e_lvds_controller_0.outclock mutrig_reset_controller_0.dpa_clock clock
add_connection mu3e_lvds_controller_0.outclock mux_mutrig2processor.clk clock
add_connection mu3e_lvds_controller_0.outclock mux_mutrig2processor_0.clk clock
add_connection mu3e_lvds_controller_0.outclock receiver_clock_125.in_clk clock
add_connection mu3e_lvds_controller_0.outclock run_control_splitter.clk clock
add_connection xcvr156_clock.clk hist_post_cdc_0.in_clk clock
add_connection xcvr156_clock.clk hist_post_splitter_0.clk clock
add_connection xcvr156_clock.clk hit_stack_subsystem_0.xcvr_clock clock
add_connection xcvr156_clock.clk hit_stack_subsystem_1.xcvr_clock clock
add_connection monitor_clock_125.clk_reset monitor_reset_sync.reset_in0 reset
add_connection monitor_reset_sync.reset_out emulator_ctrl_splitter.reset reset
add_connection monitor_reset_sync.reset_out emulator_inject_fanout.reset reset
add_connection monitor_reset_sync.reset_out emulator_mutrig_qsys_inst.data_reset reset
add_connection monitor_reset_sync.reset_out hist_post_cdc_0.out_clk_reset reset
add_connection monitor_reset_sync.reset_out hist_type0_lane0_tap.rst reset
add_connection monitor_reset_sync.reset_out hist_type0_lane1_tap.rst reset
add_connection monitor_reset_sync.reset_out hist_type0_lane2_tap.rst reset
add_connection monitor_reset_sync.reset_out hist_type0_lane3_tap.rst reset
add_connection monitor_reset_sync.reset_out hist_type0_lane4_tap.rst reset
add_connection monitor_reset_sync.reset_out hist_type0_lane5_tap.rst reset
add_connection monitor_reset_sync.reset_out hist_type0_lane6_tap.rst reset
add_connection monitor_reset_sync.reset_out hist_type0_lane7_tap.rst reset
add_connection monitor_reset_sync.reset_out hist_type1_down_tap.rst reset
add_connection monitor_reset_sync.reset_out hist_type1_up_tap.rst reset
add_connection monitor_reset_sync.reset_out histogram_statistics_0.reset reset
add_connection monitor_reset_sync.reset_out hit_stack_subsystem_0.datapath_reset reset
add_connection monitor_reset_sync.reset_out hit_stack_subsystem_1.datapath_reset reset
add_connection monitor_reset_sync.reset_out master_datapath.clk_reset reset
add_connection monitor_reset_sync.reset_out merger_0.rst reset
add_connection monitor_reset_sync.reset_out merger_1.rst reset
add_connection monitor_reset_sync.reset_out merger_2.rst reset
add_connection monitor_reset_sync.reset_out merger_3.rst reset
add_connection monitor_reset_sync.reset_out merger_4.rst reset
add_connection monitor_reset_sync.reset_out merger_5.rst reset
add_connection monitor_reset_sync.reset_out merger_6.rst reset
add_connection monitor_reset_sync.reset_out merger_7.rst reset
add_connection monitor_reset_sync.reset_out mm_clock_crossing_bridge.m0_reset reset
add_connection monitor_reset_sync.reset_out mm_pipeline_jtagmaster2rstctrl.reset reset
add_connection monitor_reset_sync.reset_out mm_pipeline_lvds_csr_emu_dbg.reset reset
add_connection monitor_reset_sync.reset_out mm_pipeline_lvds_csr_hist.reset reset
add_connection monitor_reset_sync.reset_out mm_pipeline_lvds_csr_hitstack_ring.reset reset
add_connection monitor_reset_sync.reset_out mm_pipeline_lvds_csr_low.reset reset
add_connection monitor_reset_sync.reset_out mm_pipeline_lvds_csr_mts1.reset reset
add_connection monitor_reset_sync.reset_out mm_pipeline_lvds_csr_mutrig3.reset reset
add_connection monitor_reset_sync.reset_out mm_pipeline_lvds_csr_mutrig4_mts0.reset reset
add_connection monitor_reset_sync.reset_out mm_pipeline_lvds_csr_mutrig5.reset reset
add_connection monitor_reset_sync.reset_out mm_pipeline_lvds_csr_mutrig6.reset reset
add_connection monitor_reset_sync.reset_out mm_pipeline_lvds_csr_mutrig7.reset reset
add_connection monitor_reset_sync.reset_out mts_preprocessor_0.reset_interface reset
add_connection monitor_reset_sync.reset_out mts_preprocessor_1.reset_interface reset
add_connection monitor_reset_sync.reset_out mu3e_lvds_controller_0.control_reset reset
add_connection monitor_reset_sync.reset_out mu3e_lvds_controller_0.data_reset reset
add_connection monitor_reset_sync.reset_out mutrig_datapath_subsystem_0.reset reset
add_connection monitor_reset_sync.reset_out mutrig_datapath_subsystem_1.reset reset
add_connection monitor_reset_sync.reset_out mutrig_datapath_subsystem_2.reset reset
add_connection monitor_reset_sync.reset_out mutrig_datapath_subsystem_3.reset reset
add_connection monitor_reset_sync.reset_out mutrig_datapath_subsystem_4.reset reset
add_connection monitor_reset_sync.reset_out mutrig_datapath_subsystem_5.reset reset
add_connection monitor_reset_sync.reset_out mutrig_datapath_subsystem_6.reset reset
add_connection monitor_reset_sync.reset_out mutrig_datapath_subsystem_7.reset reset
add_connection monitor_reset_sync.reset_out mutrig_injector_0.reset_interface reset
add_connection monitor_reset_sync.reset_out mutrig_reset_controller_0.dpa_reset reset
add_connection monitor_reset_sync.reset_out mux_mutrig2processor.rst reset
add_connection monitor_reset_sync.reset_out mux_mutrig2processor_0.rst reset
add_connection monitor_reset_sync.reset_out run_control_splitter.reset reset
add_connection reset_bridge_export.out_reset histogram_statistics_0.interval_reset reset
add_connection xcvr156_clock.clk_reset hist_post_cdc_0.in_clk_reset reset
add_connection xcvr156_clock.clk_reset hist_post_splitter_0.reset reset
add_connection xcvr156_clock.clk_reset hit_stack_subsystem_0.xcvr_reset reset
add_connection xcvr156_clock.clk_reset hit_stack_subsystem_1.xcvr_reset reset
add_connection master_datapath.master emulator_mutrig_qsys_inst.csr avalon
set_connection_parameter_value master_datapath.master/emulator_mutrig_qsys_inst.csr baseAddress 0x1000
add_connection master_datapath.master histogram_statistics_0.csr avalon
set_connection_parameter_value master_datapath.master/histogram_statistics_0.csr baseAddress 0x7000
add_connection master_datapath.master histogram_statistics_0.hist_bin avalon
set_connection_parameter_value master_datapath.master/histogram_statistics_0.hist_bin baseAddress 0x8000
add_connection master_datapath.master merger_0.csr avalon
set_connection_parameter_value master_datapath.master/merger_0.csr baseAddress 0x2400
add_connection master_datapath.master merger_1.csr avalon
set_connection_parameter_value master_datapath.master/merger_1.csr baseAddress 0x2480
add_connection master_datapath.master merger_2.csr avalon
set_connection_parameter_value master_datapath.master/merger_2.csr baseAddress 0x2500
add_connection master_datapath.master merger_3.csr avalon
set_connection_parameter_value master_datapath.master/merger_3.csr baseAddress 0x2580
add_connection master_datapath.master merger_4.csr avalon
set_connection_parameter_value master_datapath.master/merger_4.csr baseAddress 0x2600
add_connection master_datapath.master merger_5.csr avalon
set_connection_parameter_value master_datapath.master/merger_5.csr baseAddress 0x2680
add_connection master_datapath.master merger_6.csr avalon
set_connection_parameter_value master_datapath.master/merger_6.csr baseAddress 0x2700
add_connection master_datapath.master merger_7.csr avalon
set_connection_parameter_value master_datapath.master/merger_7.csr baseAddress 0x2780
add_connection master_datapath.master mm_pipeline_jtagmaster2rstctrl.s0 avalon
set_connection_parameter_value master_datapath.master/mm_pipeline_jtagmaster2rstctrl.s0 baseAddress 0x00011000
add_connection master_datapath.master mts_preprocessor_0.csr avalon
set_connection_parameter_value master_datapath.master/mts_preprocessor_0.csr baseAddress 0x3000
add_connection master_datapath.master mts_preprocessor_1.csr avalon
set_connection_parameter_value master_datapath.master/mts_preprocessor_1.csr baseAddress 0x4000
add_connection master_datapath.master mu3e_lvds_controller_0.csr avalon
set_connection_parameter_value master_datapath.master/mu3e_lvds_controller_0.csr baseAddress 0x0000
add_connection master_datapath.master mutrig_datapath_subsystem_0.backpressure_fifo_csr avalon
set_connection_parameter_value master_datapath.master/mutrig_datapath_subsystem_0.backpressure_fifo_csr baseAddress 0x8860
add_connection master_datapath.master mutrig_datapath_subsystem_0.csr avalon
set_connection_parameter_value master_datapath.master/mutrig_datapath_subsystem_0.csr baseAddress 0x88a0
add_connection master_datapath.master mutrig_datapath_subsystem_1.backpressure_fifo_csr avalon
set_connection_parameter_value master_datapath.master/mutrig_datapath_subsystem_1.backpressure_fifo_csr baseAddress 0x1860
add_connection master_datapath.master mutrig_datapath_subsystem_1.csr avalon
set_connection_parameter_value master_datapath.master/mutrig_datapath_subsystem_1.csr baseAddress 0x18a0
add_connection master_datapath.master mutrig_datapath_subsystem_2.backpressure_fifo_csr avalon
set_connection_parameter_value master_datapath.master/mutrig_datapath_subsystem_2.backpressure_fifo_csr baseAddress 0x2860
add_connection master_datapath.master mutrig_datapath_subsystem_2.csr avalon
set_connection_parameter_value master_datapath.master/mutrig_datapath_subsystem_2.csr baseAddress 0x28a0
add_connection master_datapath.master mutrig_datapath_subsystem_3.backpressure_fifo_csr avalon
set_connection_parameter_value master_datapath.master/mutrig_datapath_subsystem_3.backpressure_fifo_csr baseAddress 0x3860
add_connection master_datapath.master mutrig_datapath_subsystem_3.csr avalon
set_connection_parameter_value master_datapath.master/mutrig_datapath_subsystem_3.csr baseAddress 0x38a0
add_connection master_datapath.master mutrig_datapath_subsystem_4.backpressure_fifo_csr avalon
set_connection_parameter_value master_datapath.master/mutrig_datapath_subsystem_4.backpressure_fifo_csr baseAddress 0x4860
add_connection master_datapath.master mutrig_datapath_subsystem_4.csr avalon
set_connection_parameter_value master_datapath.master/mutrig_datapath_subsystem_4.csr baseAddress 0x48a0
add_connection master_datapath.master mutrig_datapath_subsystem_5.backpressure_fifo_csr avalon
set_connection_parameter_value master_datapath.master/mutrig_datapath_subsystem_5.backpressure_fifo_csr baseAddress 0x5860
add_connection master_datapath.master mutrig_datapath_subsystem_5.csr avalon
set_connection_parameter_value master_datapath.master/mutrig_datapath_subsystem_5.csr baseAddress 0x58a0
add_connection master_datapath.master mutrig_datapath_subsystem_6.backpressure_fifo_csr avalon
set_connection_parameter_value master_datapath.master/mutrig_datapath_subsystem_6.backpressure_fifo_csr baseAddress 0x6860
add_connection master_datapath.master mutrig_datapath_subsystem_6.csr avalon
set_connection_parameter_value master_datapath.master/mutrig_datapath_subsystem_6.csr baseAddress 0x68a0
add_connection master_datapath.master mutrig_datapath_subsystem_7.backpressure_fifo_csr avalon
set_connection_parameter_value master_datapath.master/mutrig_datapath_subsystem_7.backpressure_fifo_csr baseAddress 0x7860
add_connection master_datapath.master mutrig_datapath_subsystem_7.csr avalon
set_connection_parameter_value master_datapath.master/mutrig_datapath_subsystem_7.csr baseAddress 0x78a0
add_connection master_datapath.master mutrig_injector_0.csr avalon
set_connection_parameter_value master_datapath.master/mutrig_injector_0.csr baseAddress 0xa000
add_connection mm_clock_crossing_bridge.m0 mm_pipeline_lvds_csr_emu_dbg.s0 avalon
set_connection_parameter_value mm_clock_crossing_bridge.m0/mm_pipeline_lvds_csr_emu_dbg.s0 baseAddress 0x2000
add_connection mm_clock_crossing_bridge.m0 mm_pipeline_lvds_csr_hist.s0 avalon
set_connection_parameter_value mm_clock_crossing_bridge.m0/mm_pipeline_lvds_csr_hist.s0 baseAddress 0xa000
add_connection mm_clock_crossing_bridge.m0 mm_pipeline_lvds_csr_hitstack_ring.s0 avalon
set_connection_parameter_value mm_clock_crossing_bridge.m0/mm_pipeline_lvds_csr_hitstack_ring.s0 baseAddress 0xb000
add_connection mm_clock_crossing_bridge.m0 mm_pipeline_lvds_csr_low.s0 avalon
set_connection_parameter_value mm_clock_crossing_bridge.m0/mm_pipeline_lvds_csr_low.s0 baseAddress 0x0000
add_connection mm_clock_crossing_bridge.m0 mm_pipeline_lvds_csr_mts1.s0 avalon
set_connection_parameter_value mm_clock_crossing_bridge.m0/mm_pipeline_lvds_csr_mts1.s0 baseAddress 0x8000
add_connection mm_clock_crossing_bridge.m0 mm_pipeline_lvds_csr_mutrig3.s0 avalon
set_connection_parameter_value mm_clock_crossing_bridge.m0/mm_pipeline_lvds_csr_mutrig3.s0 baseAddress 0x3000
add_connection mm_clock_crossing_bridge.m0 mm_pipeline_lvds_csr_mutrig4_mts0.s0 avalon
set_connection_parameter_value mm_clock_crossing_bridge.m0/mm_pipeline_lvds_csr_mutrig4_mts0.s0 baseAddress 0x4000
add_connection mm_clock_crossing_bridge.m0 mm_pipeline_lvds_csr_mutrig5.s0 avalon
set_connection_parameter_value mm_clock_crossing_bridge.m0/mm_pipeline_lvds_csr_mutrig5.s0 baseAddress 0x5000
add_connection mm_clock_crossing_bridge.m0 mm_pipeline_lvds_csr_mutrig6.s0 avalon
set_connection_parameter_value mm_clock_crossing_bridge.m0/mm_pipeline_lvds_csr_mutrig6.s0 baseAddress 0x6000
add_connection mm_clock_crossing_bridge.m0 mm_pipeline_lvds_csr_mutrig7.s0 avalon
set_connection_parameter_value mm_clock_crossing_bridge.m0/mm_pipeline_lvds_csr_mutrig7.s0 baseAddress 0x7000
add_connection mm_pipeline_jtagmaster2rstctrl.m0 mutrig_reset_controller_0.reconfig_mgmt avalon
set_connection_parameter_value mm_pipeline_jtagmaster2rstctrl.m0/mutrig_reset_controller_0.reconfig_mgmt baseAddress 0x0000
add_connection mm_pipeline_lvds_csr_emu_dbg.m0 emulator_mutrig_qsys_inst.csr avalon
set_connection_parameter_value mm_pipeline_lvds_csr_emu_dbg.m0/emulator_mutrig_qsys_inst.csr baseAddress 0x0000
add_connection mm_pipeline_lvds_csr_emu_dbg.m0 merger_0.csr avalon
set_connection_parameter_value mm_pipeline_lvds_csr_emu_dbg.m0/merger_0.csr baseAddress 0x0100
add_connection mm_pipeline_lvds_csr_emu_dbg.m0 merger_1.csr avalon
set_connection_parameter_value mm_pipeline_lvds_csr_emu_dbg.m0/merger_1.csr baseAddress 0x0120
add_connection mm_pipeline_lvds_csr_emu_dbg.m0 merger_2.csr avalon
set_connection_parameter_value mm_pipeline_lvds_csr_emu_dbg.m0/merger_2.csr baseAddress 0x0140
add_connection mm_pipeline_lvds_csr_emu_dbg.m0 merger_3.csr avalon
set_connection_parameter_value mm_pipeline_lvds_csr_emu_dbg.m0/merger_3.csr baseAddress 0x0160
add_connection mm_pipeline_lvds_csr_emu_dbg.m0 merger_4.csr avalon
set_connection_parameter_value mm_pipeline_lvds_csr_emu_dbg.m0/merger_4.csr baseAddress 0x0180
add_connection mm_pipeline_lvds_csr_emu_dbg.m0 merger_5.csr avalon
set_connection_parameter_value mm_pipeline_lvds_csr_emu_dbg.m0/merger_5.csr baseAddress 0x01a0
add_connection mm_pipeline_lvds_csr_emu_dbg.m0 merger_6.csr avalon
set_connection_parameter_value mm_pipeline_lvds_csr_emu_dbg.m0/merger_6.csr baseAddress 0x01c0
add_connection mm_pipeline_lvds_csr_emu_dbg.m0 merger_7.csr avalon
set_connection_parameter_value mm_pipeline_lvds_csr_emu_dbg.m0/merger_7.csr baseAddress 0x01e0
add_connection mm_pipeline_lvds_csr_emu_dbg.m0 mutrig_datapath_subsystem_2.backpressure_fifo_csr avalon
set_connection_parameter_value mm_pipeline_lvds_csr_emu_dbg.m0/mutrig_datapath_subsystem_2.backpressure_fifo_csr baseAddress 0x0860
add_connection mm_pipeline_lvds_csr_emu_dbg.m0 mutrig_datapath_subsystem_2.csr avalon
set_connection_parameter_value mm_pipeline_lvds_csr_emu_dbg.m0/mutrig_datapath_subsystem_2.csr baseAddress 0x08a0
add_connection mm_pipeline_lvds_csr_hist.m0 histogram_statistics_0.csr avalon
set_connection_parameter_value mm_pipeline_lvds_csr_hist.m0/histogram_statistics_0.csr baseAddress 0x0400
add_connection mm_pipeline_lvds_csr_hist.m0 histogram_statistics_0.hist_bin avalon
set_connection_parameter_value mm_pipeline_lvds_csr_hist.m0/histogram_statistics_0.hist_bin baseAddress 0x0000
add_connection mm_pipeline_lvds_csr_hitstack_ring.m0 mutrig_injector_0.csr avalon
set_connection_parameter_value mm_pipeline_lvds_csr_hitstack_ring.m0/mutrig_injector_0.csr baseAddress 0x0200
add_connection mm_pipeline_lvds_csr_low.m0 mm_pipeline_jtagmaster2rstctrl.s0 avalon
set_connection_parameter_value mm_pipeline_lvds_csr_low.m0/mm_pipeline_jtagmaster2rstctrl.s0 baseAddress 0x1100
add_connection mm_pipeline_lvds_csr_low.m0 mu3e_lvds_controller_0.csr avalon
set_connection_parameter_value mm_pipeline_lvds_csr_low.m0/mu3e_lvds_controller_0.csr baseAddress 0x0000
add_connection mm_pipeline_lvds_csr_low.m0 mutrig_datapath_subsystem_0.backpressure_fifo_csr avalon
set_connection_parameter_value mm_pipeline_lvds_csr_low.m0/mutrig_datapath_subsystem_0.backpressure_fifo_csr baseAddress 0x1000
